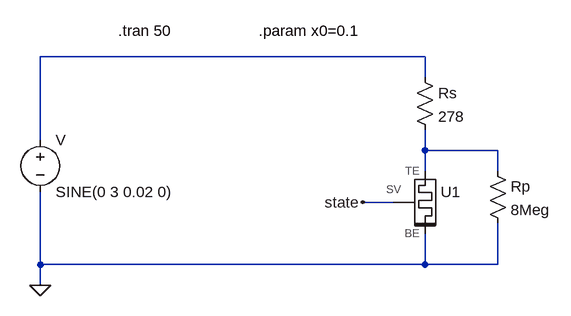
[diagram p0: schematic sine_input.asc]
sine_input.asc, the LTspice schematic file:
Version 4
SHEET 1 1352 680
WIRE 384 -160 -208 -160
WIRE 384 -128 384 -160
WIRE -208 -32 -208 -160
WIRE 384 -16 384 -48
WIRE 496 -16 384 -16
WIRE 384 16 384 -16
WIRE 496 16 496 -16
WIRE 336 64 288 64
WIRE -208 160 -208 48
WIRE 384 160 384 112
WIRE 384 160 -208 160
WIRE 496 160 496 96
WIRE 496 160 384 160
WIRE -208 192 -208 160
FLAG 288 64 state
FLAG -208 192 0
SYMBOL res 368 -144 R0
SYMATTR InstName Rs
SYMATTR Value 278
SYMBOL res 480 0 R0
SYMATTR InstName Rp
SYMATTR Value 8Meg
SYMBOL voltage -208 -48 R0
WINDOW 123 0 0 Left 0
WINDOW 39 0 0 Left 0
SYMATTR InstName V
SYMATTR Value SINE(0 3 0.02 0)
SYMBOL Memristor 368 16 R0
SYMATTR InstName U1
TEXT -88 -200 Left 2 !.tran 50
TEXT 128 -200 Left 2 !.param x0=0.1

The netlist it stands for:
* sine_input.asc
Rs N001 N002 278
Rp N002 0 8Meg
V N001 0 SINE(0 3 0.02 0)
XU1 N002 0 state MEM_NAMLAB_CORE  ; pins TE BE SV
.tran 50
.param x0=0.1
.lib MEM_NAMLAB_CORE.sub
.backanno
.end